# EAGLE design smd_preamp_with_TALL_jacks (EAGLE 9.1.3)
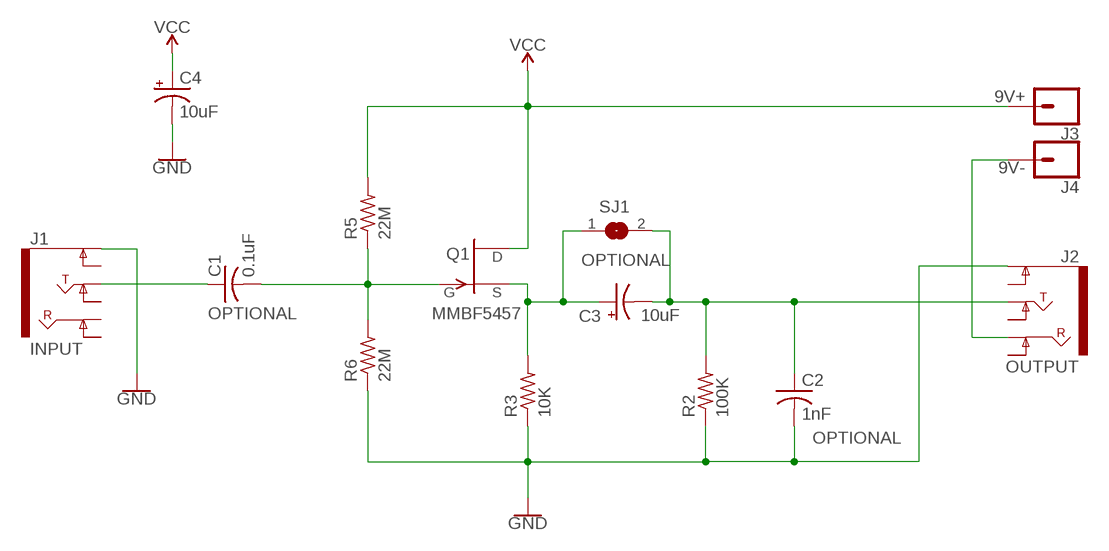
[diagram p0: schematic, sheet 1]

## Parts
C1  0.1uF  C-USC0805  [C0805]
C2  1nF  C-USC0805  [C0805]
C3  10uF  732-8411-1-ND  [732-8411-1-ND_SMD]
C4  10uF  732-8411-1-ND  [732-8411-1-ND_SMD]
J1  INPUT  CLIFF_.25"_TRS_JACK  [CLIFF_AUDIO_JACK_0.25"_TRS_PTH_RA]
J2  OUTPUT  CLIFF_.25"_TRS_JACK  [CLIFF_AUDIO_JACK_0.25"_TRS_PTH_RA]
J3  9V+  CONN_01  [1X01]
J4  9V-  CONN_01  [1X01]
Q1  MMBF5457  SST5484  [SOT23]
R2  100K  R-US_R0805  [R0805]
R3  10K  R-US_R0805  [R0805]
R5  22M  R-US_R0805  [R0805]
R6  22M  R-US_R0805  [R0805]
SJ1  SJ  [SJ]

## Nets
GATE: C1.2 Q1.3(G) R5.1 R6.2
GND: C2.2 C4.- J1.SLEEVE(EARTH) J2.SLEEVE(EARTH) R2.1 R3.1 R6.1
N$1: C1.1 J1.TIP
N$5: J2.RING J4.1
N$7: C2.1 C3.- J2.TIP R2.2 SJ1.2
SOURCE: C3.+ Q1.2(S) R3.2 SJ1.1
VCC: C4.+ J3.1 Q1.1(D) R5.2
Unconnected: J1.RING J1.RING-NORM J1.SLEEVE-NORM(EARTH-NORM) J1.TIP-NORM J2.RING-NORM J2.SLEEVE-NORM(EARTH-NORM) J2.TIP-NORM

## Notes on the sheet
- OPTIONAL
- OPTIONAL
- OPTIONAL

## Library data of the parts
C1 C2 = adafruit:C-US: CAPACITOR, American symbol
C3 C4 = rahji:732-8411-1-ND: Digikey p/n 732-8411-1-ND SMD 10uF Electrolytic Capacitor Product Page <https://www.digikey.com/scripts/DkSearch/dksus.dll?Detail&itemSeq=263933724&uq=636646768770520204>
J1 J2 = rahji:CLIFF_.25"_TRS_JACK
J3 J4 = SparkFun-Connectors:CONN_01: Single connection point. Often used as Generic Header-pin footprint for 0.1 inch spaced/style header connections On any of the 0.1 inch spaced packages, you can populate with these: Break Away Headers - Straight <https://www.sparkfun.com/products/116> (PRT-00116) Break Away Male Headers - Right Angle <https://www.sparkfun.com/products/553> (PRT-00553) Female Headers <https://www.sparkfun.com/products/115> (PRT-00115) Break Away Headers - Machine Pin <https://www.sparkfun.com/products/117> (PRT-00117) Break Away Female Headers - Swiss Machine Pin <https://www.sparkfun.com/products/743> (PRT-00743) This device is also useful as a general connection point to wire up your design to another part of your project. Our various solder wires solder well into these plated through hole pads. Hook-Up Wire - Assortment (Stranded, 22 AWG) <https://www.sparkfun.com/products/11375> (PRT-11375) Hook-Up Wire - Assortment (Solid Core, 22 AWG) <https://www.sparkfun.com/products/11367> (PRT-11367) View the entire wire category on our website here <https://www.sparkfun.com/categories/141> Special notes: SMTSO-256-ET is a "flush mount" nut for a 4-40 screw. We mostly use this on specialty testbeds; it is a nice way to connect hardware to your PCB at an adjustable hieght. Also note, the SNAP packages are for using a snappable style connector. We sell a baggie of snaps and they are also used on two LilyPad designs: Snap Assortment - 30 pack (male and female) <https://www.sparkfun.com/products/11347> (DEV-11347) LilyPad Arduino SimpleSnap <https://www.sparkfun.com/products/10941> (DEV-10941) LilyPad SimpleSnap Protoboard <https://www.sparkfun.com/products/10940> (DEV-10940)
Q1 = transistor-fet:?548*: N-Channel JFETs Source: VISHAY 2N5484.pdf Compatible: TO92 2N5245 J304 J305 U310 J308 J309 J310 TO72 2N4416 2N4416A 2N3823 2N4351 3N169 3N170 3N171 MFE3002 TO18 2N3796 2N3797 MFE825 Source: Motorola European Master Guide Pacge 3-59
R2 R3 R5 R6 = adafruit:R-US_: RESISTOR, American symbol
SJ1 = jumper:SJ: SMD solder JUMPER

## Board
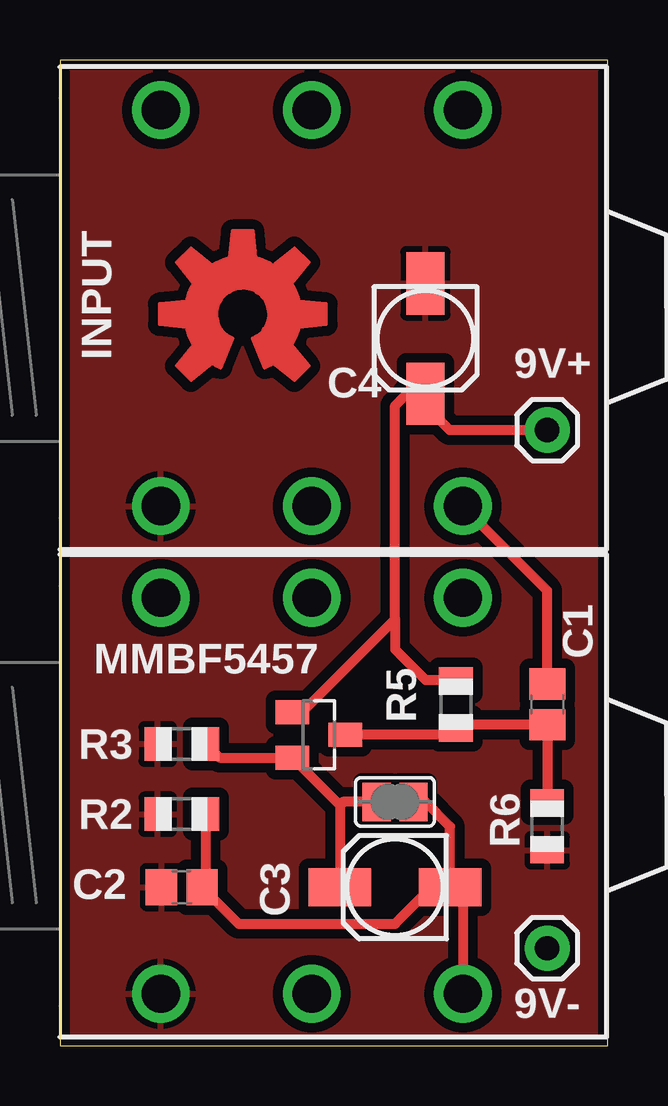
[diagram p1: board, top side]
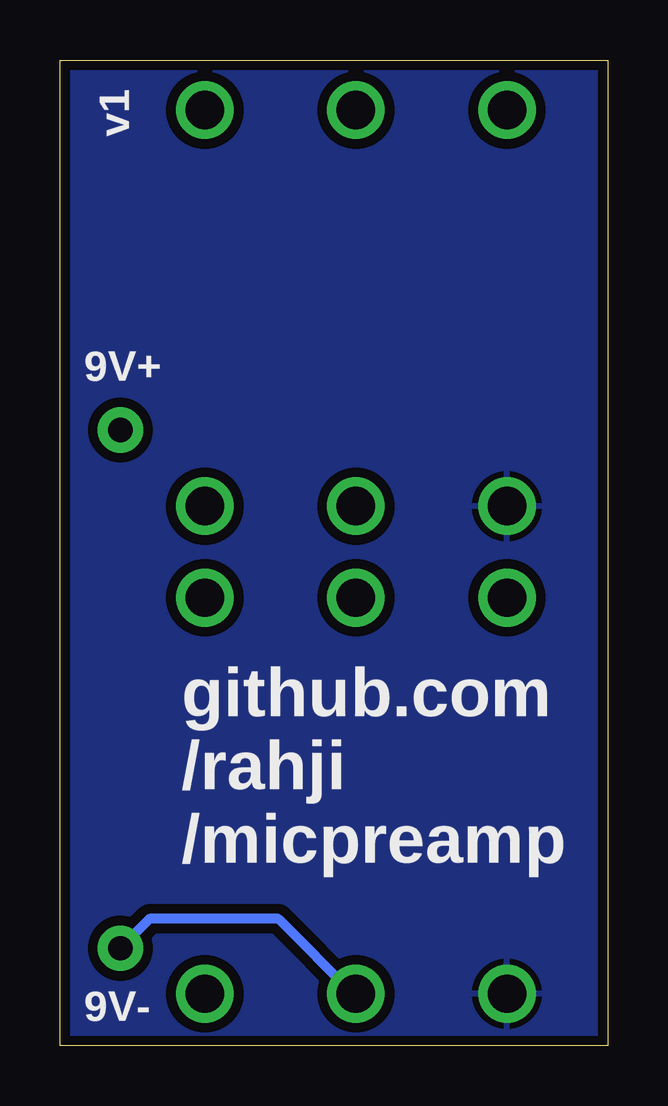
[diagram p2: board, bottom side, seen from below]

Size 22.84 x 41.07 mm. Coordinates in mm from the lower left corner, seen from the top.
Outline: 0,0 22.84,0 22.84,41.07 0,41.07 0,0
Copper layers (1*16): Top 0.0356mm / dielectric 1.5011mm / Bottom 0.0356mm
Design rules "oshpark-2layer": minimum track width 6mil, minimum drill 13mil, track to track 6mil, track to pad 6mil, pad to pad 6mil, via to via 6mil, smd to smd 6mil, copper to edge 15mil, drill to drill 6mil, minimum pad ring 7mil, minimum via ring 7mil, stop-mask expansion 2.5mil, vias tented up to drill 0mil, thermal gap 10mil

### Footprints (pad centres in the part's own frame; a part is rotated, then mirrored left to right if it is on the bottom)
C0805 = smd 1.3 x 1.5: 1 -0.85,0; 2 0.85,0
732-8411-1-ND_SMD = smd 2.6 x 1.6: + 2.3,0; - -2.3,0
CLIFF_AUDIO_JACK_0.25"_TRS_PTH_RA = drill 1.6: RING 10.5,-8.25; RING-NORM 10.5,8.25; SLEEVE 4.2,-8.25; SLEEVE-NORM 4.2,8.25; TIP 16.8,-8.25; TIP-NORM 16.8,8.25
1X01 = drill 1.016 pad 1.88: 1 0,0
SOT23 = smd 1 x 1.4: 1 -0.95,-1.1; 2 0.95,-1.1; 3 0,1.1
R0805 = smd 1.1 x 1.4: 1 -1,0; 2 1,0
SJ = smd 1.168 x 1.6: 1 -0.762,0; 2 0.762,0

### Placement (x,y rotation side)
C1  20.32,14.22 270 top
C2  5.08,6.6 180 top
C3  13.97,6.6 180 top
C4  15.24,29.46 270 top
J1  0,30.73 0 top
J2  0,10.41 0 top
J3  20.32,25.65 0 top
J4  20.32,4.06 0 top
Q1  10.79,12.95 270 top
R2  5.08,9.65 0 top
R3  5.08,12.57 0 top
R5  16.51,14.22 90 top
R6  20.32,9.14 90 top
SJ1  13.97,10.16 0 top
U$1  [OSHW-LOGO-L_COPPER]  7.62,30.48 0 top

### Tracks (layer width: path | path; a pad name or v marks a point on that pad's centre or on a via)
GATE
  Top 0.406: R6.2 C1.2 16.66,13.37 R5.1 16.24,12.95 Q1.3
GND
  pour Top (isolate 0.406): 0,43.18 25.4,43.18 25.4,0 0,0
  pour Bottom (isolate 0.406): 0,42.16 24.13,42.16 24.13,-1.27 0,-1.27
N$1
  Top 0.406: C1.1 20.32,18.96 J1.TIP
N$5
  Bottom 0.406: J4.1 19.1,5.28 13.73,5.28 10.61,2.16 J2.RING
N$7
  Top 0.406: 15.88,6.99 C3.- 16.27,9.13 15.24,10.16 SJ1.2 | 15.88,6.99 16.8,7.09 J2.TIP | R2.2 6.08,6.75 C2.1 7.45,5.08 13.97,5.08 15.88,6.99
SOURCE
  Top 0.406: R3.2 6.65,12 Q1.2 11.67,10.03 | 11.67,10.03 C3.+ | SJ1.1 11.8,10.16 11.67,10.03
VCC
  Top 0.406: Q1.1 10.09,13.9 13.97,17.78 | 13.97,17.78 13.97,26.67 14.85,27.55 C4.+ 15.24,26.67 16.26,25.65 J3.1 | 13.97,17.78 13.97,16.51 15.24,15.24 16.49,15.24 R5.2

### Text on the board
tNames: INPUT | 9V+ | MMBF5457 | 9V-
bNames: v1 | 9V+ | github.com / /rahji / /micpreamp | 9V-
tValues: 9V+ | 9V-
bValues: -